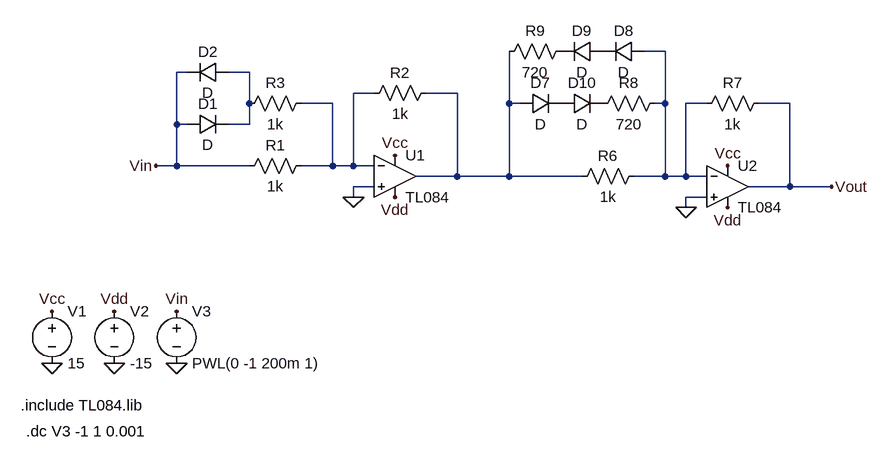
[diagram p0: schematic Arcsin.asc]
Arcsin.asc, the LTspice schematic file:
Version 4
SHEET 1 996 680
WIRE 656 -16 624 -16
WIRE -80 16 -96 16
WIRE 16 16 -16 16
WIRE 208 48 176 48
WIRE 336 48 288 48
WIRE 16 64 16 16
WIRE 144 64 96 64
WIRE 416 64 416 -16
WIRE 432 64 416 64
WIRE 656 64 656 -16
WIRE 656 64 640 64
WIRE 720 64 688 64
WIRE 848 64 800 64
WIRE -96 96 -96 16
WIRE -80 96 -96 96
WIRE 16 96 16 64
WIRE 16 96 -16 96
WIRE -96 160 -96 96
WIRE -96 160 -128 160
WIRE 16 160 -96 160
WIRE 144 160 144 64
WIRE 144 160 96 160
WIRE 176 160 176 48
WIRE 176 160 144 160
WIRE 208 160 176 160
WIRE 336 176 336 48
WIRE 336 176 272 176
WIRE 416 176 416 64
WIRE 416 176 336 176
WIRE 528 176 416 176
WIRE 656 176 656 64
WIRE 656 176 608 176
WIRE 688 176 688 64
WIRE 688 176 656 176
WIRE 720 176 688 176
WIRE 208 192 176 192
WIRE 848 192 848 64
WIRE 848 192 784 192
WIRE 912 192 848 192
WIRE 176 208 176 192
WIRE 720 208 688 208
WIRE 688 224 688 208
FLAG 176 208 0
FLAG -96 464 0
FLAG -192 464 0
FLAG -288 464 0
FLAG -288 384 Vcc
FLAG 240 144 Vcc
FLAG -192 384 Vdd
FLAG 240 208 Vdd
FLAG -96 384 Vin
FLAG -128 160 Vin
FLAG 688 224 0
FLAG 752 160 Vcc
FLAG 752 224 Vdd
FLAG 912 192 Vout
SYMBOL res 112 144 R90
WINDOW 0 0 56 VBottom 2
WINDOW 3 32 56 VTop 2
SYMATTR InstName R1
SYMATTR Value 1k
SYMBOL res 304 32 R90
WINDOW 0 0 56 VBottom 2
WINDOW 3 32 56 VTop 2
SYMATTR InstName R2
SYMATTR Value 1k
SYMBOL res 112 48 R90
WINDOW 0 0 56 VBottom 2
WINDOW 3 32 56 VTop 2
SYMATTR InstName R3
SYMATTR Value 1k
SYMBOL Opamps\\opamp2 240 112 R0
SYMATTR InstName U1
SYMATTR Value TL084
SYMBOL diode -80 112 R270
WINDOW 0 32 32 VTop 2
WINDOW 3 0 32 VBottom 2
SYMATTR InstName D1
SYMBOL diode -16 0 R90
WINDOW 0 0 32 VBottom 2
WINDOW 3 32 32 VTop 2
SYMATTR InstName D2
SYMBOL voltage -288 368 R0
WINDOW 123 0 0 Left 0
WINDOW 39 0 0 Left 0
SYMATTR InstName V1
SYMATTR Value 15
SYMBOL voltage -192 368 R0
WINDOW 123 0 0 Left 0
WINDOW 39 0 0 Left 0
SYMATTR InstName V2
SYMATTR Value -15
SYMBOL voltage -96 368 R0
WINDOW 123 0 0 Left 0
WINDOW 39 0 0 Left 0
SYMATTR InstName V3
SYMATTR Value PWL(0 -1 200m 1)
SYMBOL res 624 160 R90
WINDOW 0 0 56 VBottom 2
WINDOW 3 32 56 VTop 2
SYMATTR InstName R6
SYMATTR Value 1k
SYMBOL res 816 48 R90
WINDOW 0 0 56 VBottom 2
WINDOW 3 32 56 VTop 2
SYMATTR InstName R7
SYMATTR Value 1k
SYMBOL Opamps\\opamp2 752 128 R0
SYMATTR InstName U2
SYMATTR Value TL084
SYMBOL diode 432 80 R270
WINDOW 0 32 32 VTop 2
WINDOW 3 0 32 VBottom 2
SYMATTR InstName D7
SYMBOL diode 624 -32 R90
WINDOW 0 0 32 VBottom 2
WINDOW 3 32 32 VTop 2
SYMATTR InstName D8
SYMBOL diode 560 -32 R90
WINDOW 0 0 32 VBottom 2
WINDOW 3 32 32 VTop 2
SYMATTR InstName D9
SYMBOL diode 496 80 R270
WINDOW 0 32 32 VTop 2
WINDOW 3 0 32 VBottom 2
SYMATTR InstName D10
SYMBOL res 656 48 R90
WINDOW 0 0 56 VBottom 2
WINDOW 3 32 56 VTop 2
SYMATTR InstName R8
SYMATTR Value 720
SYMBOL res 512 -32 R90
WINDOW 0 0 56 VBottom 2
WINDOW 3 32 56 VTop 2
SYMATTR InstName R9
SYMATTR Value 720
TEXT -336 528 Left 2 !.include TL084.lib
TEXT -328 568 Left 2 !.dc V3 -1 1 0.001

The netlist it stands for:
* Arcsin.asc
R1 N003 Vin 1k
R2 N004 N003 1k
R3 N003 N002 1k
XU1 0 N003 Vcc Vdd N004 TL084  ; pins In+ In- V+ V- OUT
D1 Vin N002 D
D2 N002 Vin D
V1 Vcc 0 15
V2 Vdd 0 -15
V3 Vin 0 PWL(0 -1 200m 1)
R6 N001 N004 1k
R7 Vout N001 1k
XU2 0 N001 Vcc Vdd Vout TL084  ; pins In+ In- V+ V- OUT
D7 N004 P001 D
D8 N001 P002 D
D9 P002 P003 D
D10 P001 P004 D
R8 N001 P004 720
R9 P003 N004 720
.model D D
.lib standard.dio
.include TL084.lib
.dc V3 -1 1 0.001
.backanno
.end

* Results of the author's LTspice run, read from the files saved beside the schematic
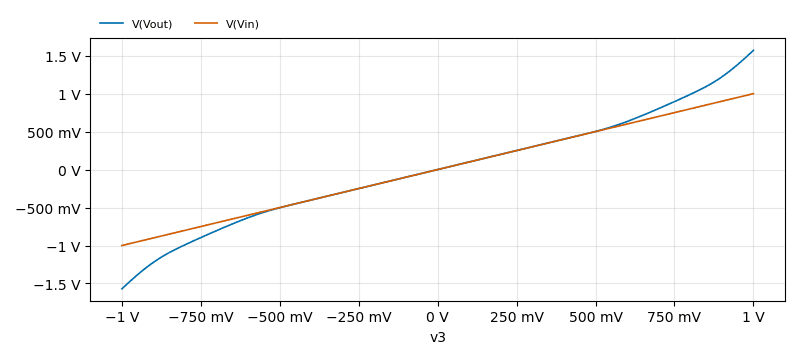
[diagram p1: DC transfer characteristic of Arcsin.asc, plotted from the saved traces]
* DC transfer characteristic, 1 run:
*   V(Vout): -1.57 V at v3=-1 V, 1.57 V at v3=1 V, min -1.57 V, max 1.57 V
*   V(Vin): -1 V at v3=-1 V, 1 V at v3=1 V, min -1 V, max 1 V